# EAGLE design 9x Connection Board A v0.2 (EAGLE 6.5.0)
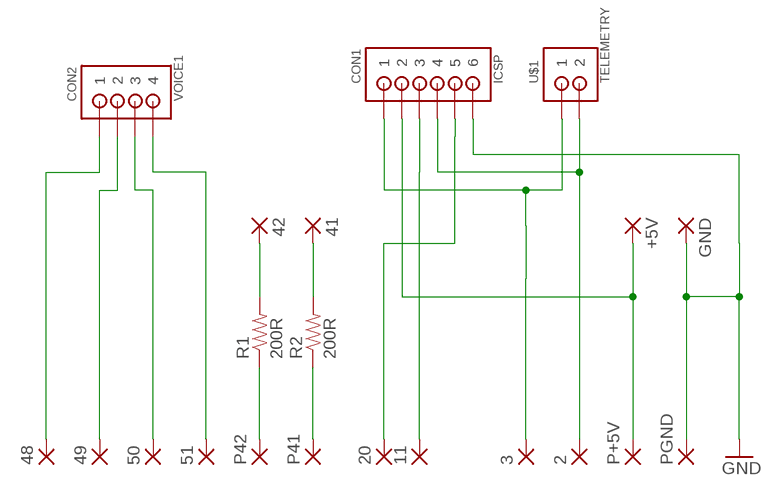
[diagram p0: schematic, sheet 1]

## Parts
2  WIREPADSMD1,27-254  [SMD1,27-2,54]
3  WIREPADSMD1,27-254  [SMD1,27-2,54]
11  WIREPADSMD1,27-254  [SMD1,27-2,54]
20  WIREPADSMD1,27-254  [SMD1,27-2,54]
41  WIREPADSMD1,27-254  [SMD1,27-2,54]
42  WIREPADSMD1,27-254  [SMD1,27-2,54]
48  WIREPADSMD1,27-254  [SMD1,27-2,54]
49  WIREPADSMD1,27-254  [SMD1,27-2,54]
50  WIREPADSMD1,27-254  [SMD1,27-2,54]
51  WIREPADSMD1,27-254  [SMD1,27-2,54]
+5V  WIREPADSMD1,27-254  [SMD1,27-2,54]
CON1  ICSP  B6B-ZR  [B6B-ZR]
CON2  VOICE1  B4B-ZR  [B4B-ZR]
GND  WIREPADSMD1,27-254  [SMD1,27-2,54]
P41  WIREPADSMD1,27-254  [SMD1,27-2,54]
P42  WIREPADSMD1,27-254  [SMD1,27-2,54]
P+5V  WIREPADSMD1,27-254  [SMD1,27-2,54]
PGND  WIREPADSMD1,27-254  [SMD1,27-2,54]
R1  200R  RESISTOR0805-RES  [0805]
R2  200R  RESISTOR0805-RES  [0805]
U$1  TELEMETRY  B2B-ZR  [B2B-ZR]

## Nets
+5V: +5V.1(P) CON1.2 P+5V.1(P)
AD0: 51.1(P) CON2.4
AD1: 50.1(P) CON2.3
AD2: 49.1(P) CON2.2
AD3: 48.1(P) CON2.1
GND: CON1.6 GND.1(P) PGND.1(P)
MISO: 3.1(P) CON1.1 U$1.1
MOSI: 2.1(P) CON1.4 U$1.2
N$1: P42.1(P) R1.1
N$2: P41.1(P) R2.1
N$3: 42.1(P) R1.2
N$4: 41.1(P) R2.2
RST: 20.1(P) CON1.5
SCK: 11.1(P) CON1.3

## Library data of the parts
2 3 11 20 41 42 48-51 +5V GND P41 P42 P+5V PGND = wirepad:WIREPAD: Wire PAD connect wire on PCB
CON1 = jst:B6B-ZR: JST-ZH Connector 6 pol, 1.5mm pitch Package: B6B-ZR Source: http://www.jst-mfg.com/product/pdf/eng/eZH.pdf
CON2 = jst:B4B-ZR: JST-ZH Connector 4 pol, 1.5mm pitch Package: B4B-ZR Source: http://www.jst-mfg.com/product/pdf/eng/eZH.pdf
R1 R2 = SparkFun-Resistors:RESISTOR: Resistor Basic schematic elements and footprints for 0603, 1206, and PTH resistors.
U$1 = jdc:B2B-ZR: JST-ZH Connector 2 pol, 1.5mm pitch Package: B2B-ZR Source: http://www.jst-mfg.com/product/pdf/eng/eZH.pdf

## Board
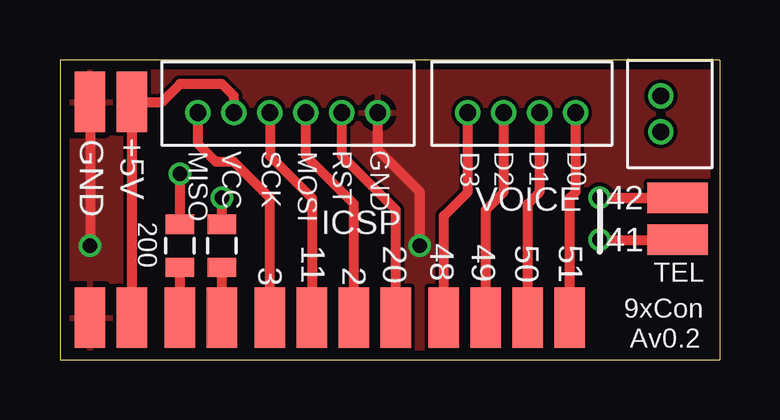
[diagram p1: board, top side]
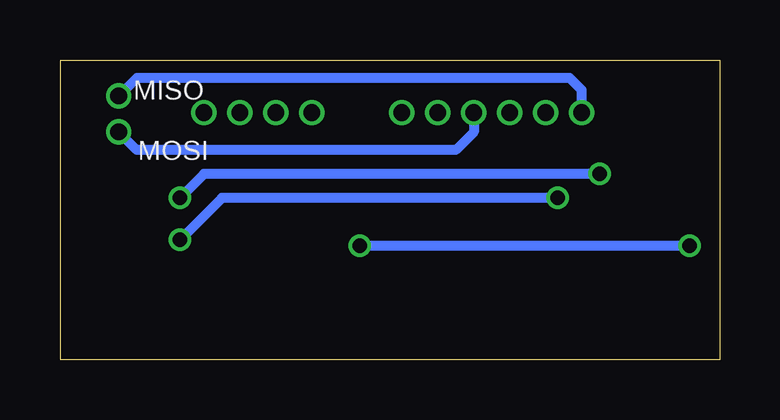
[diagram p2: board, bottom side, seen from below]

Size 27.5 x 12.5 mm. Coordinates in mm from the lower left corner, seen from the top.
Outline: 0,0 27.5,0 27.5,12.5 0,12.5 0,0
Copper layers (1*16): Top 0.0356mm / dielectric 1.5011mm / Bottom 0.0356mm
Design rules "LaenPCBOrder *": minimum track width 6mil, minimum drill 13mil, track to track 6mil, track to pad 6mil, pad to pad 6mil, via to via 6mil, smd to smd 6mil, copper to edge 15mil, drill to drill 6mil, minimum pad ring 7mil, minimum via ring 7mil, stop-mask expansion 4mil, vias tented up to drill 24mil, thermal gap 10mil

### Footprints (pad centres in the part's own frame; a part is rotated, then mirrored left to right if it is on the bottom)
SMD1,27-2,54 = smd 1.27 x 2.54: 1 0,0
B6B-ZR = drill 0.7: 1 9,-1.3; 2 7.5,-1.3; 3 6,-1.3; 4 4.5,-1.3; 5 3,-1.3; 6 1.5,-1.3
B4B-ZR = drill 0.7: 1 6,-1.3; 2 4.5,-1.3; 3 3,-1.3; 4 1.5,-1.3
0805 = smd 0.8 x 1.2: 1 -0.9,0; 2 0.9,0
B2B-ZR = drill 0.7: 1 3,-1.3; 2 1.5,-1.3

### Placement (x,y rotation side)
2  12.25,1.75 0 top
3  8.75,1.75 0 top
11  10.5,1.75 0 top
20  14,1.75 0 top
41  25.75,5 270 top
42  25.75,6.75 270 top
48  16,1.75 0 top
49  17.75,1.75 0 top
50  19.5,1.75 0 top
51  21.25,1.75 0 top
+5V  3,10.75 0 top
CON1  14.75,9 180 top
CON2  23,9 180 top
GND  1.25,10.75 0 top
P41  6.75,1.75 0 top
P42  5,1.75 0 top
P+5V  3,1.75 0 top
PGND  1.25,1.75 0 top
R1  5,4.75 90 top
R2  6.75,4.75 90 top
U$1  23.75,8 90 top

### Tracks (layer width: path | path; a pad name or v marks a point on that pad's centre or on a via)
+5V
  Top 0.406: CON1.2 7.25,11 6.75,11.5 5,11.5 4.5,11 4.25,10.75 +5V.1 P+5V.1
AD0
  Top 0.406: 51.1 21.25,6.75 21.5,7 CON2.4
AD1
  Top 0.406: 50.1 19.5,6.5 20,7 CON2.3
AD2
  Top 0.406: 49.1 17.75,6.25 18.5,7 CON2.2
AD3
  Top 0.406: 48.1 16,6 17,7 CON2.1
GND  (via drill 0.6)
  Top 0.406: GND.1 v1.25,4.75 | v15,4.75 15,7 13.25,8.75 CON1.6
  Bottom 0.406: v1.25,4.75 v15,4.75
  pour Top: -0.5,-0.5 28,-0.5 28,13 -0.5,13
MISO
  Top 0.406: 3.1 8.75,6.75 7.25,8.25 6.5,8.25 5.75,9 CON1.1
  Bottom 0.406: CON1.1 5.75,11.25 6.25,11.75 24.3,11.75 U$1.1
MOSI
  Top 0.406: 2.1 12.25,6.5 10.25,8.5 CON1.4
  Bottom 0.406: CON1.4 10.25,9.5 11,8.75 24.3,8.75 U$1.2
N$1
  Top 0.406: P42.1 R1.1
N$2
  Top 0.406: P41.1 R2.1
N$3  (via drill 0.6)
  Top 0.406: R1.2 v5,7.75 | 42.1 v22.5,6.75 42.1
  Bottom 0.406: v5,7.75 21.5,7.75 v22.5,6.75
N$4  (via drill 0.6)
  Top 0.406: R2.2 v6.75,6.75 | v22.5,5 41.1
  Bottom 0.406: v6.75,6.75 20.75,6.75 v22.5,5
RST
  Top 0.406: 20.1 14,6.25 11.75,8.5 CON1.5
SCK
  Top 0.406: CON1.3 8.75,8.5 10.5,6.75 11.1

### Text on the board
tNames: MISO | VCC | SCK | MOSI | RST | GND | D3 | D2 | D1 | D0 | 200 | VOICE | ICSP | TEL | 9xCon | Av0.2
bNames: MISO | MOSI